# EAGLE design circuit (EAGLE 9.6.2)
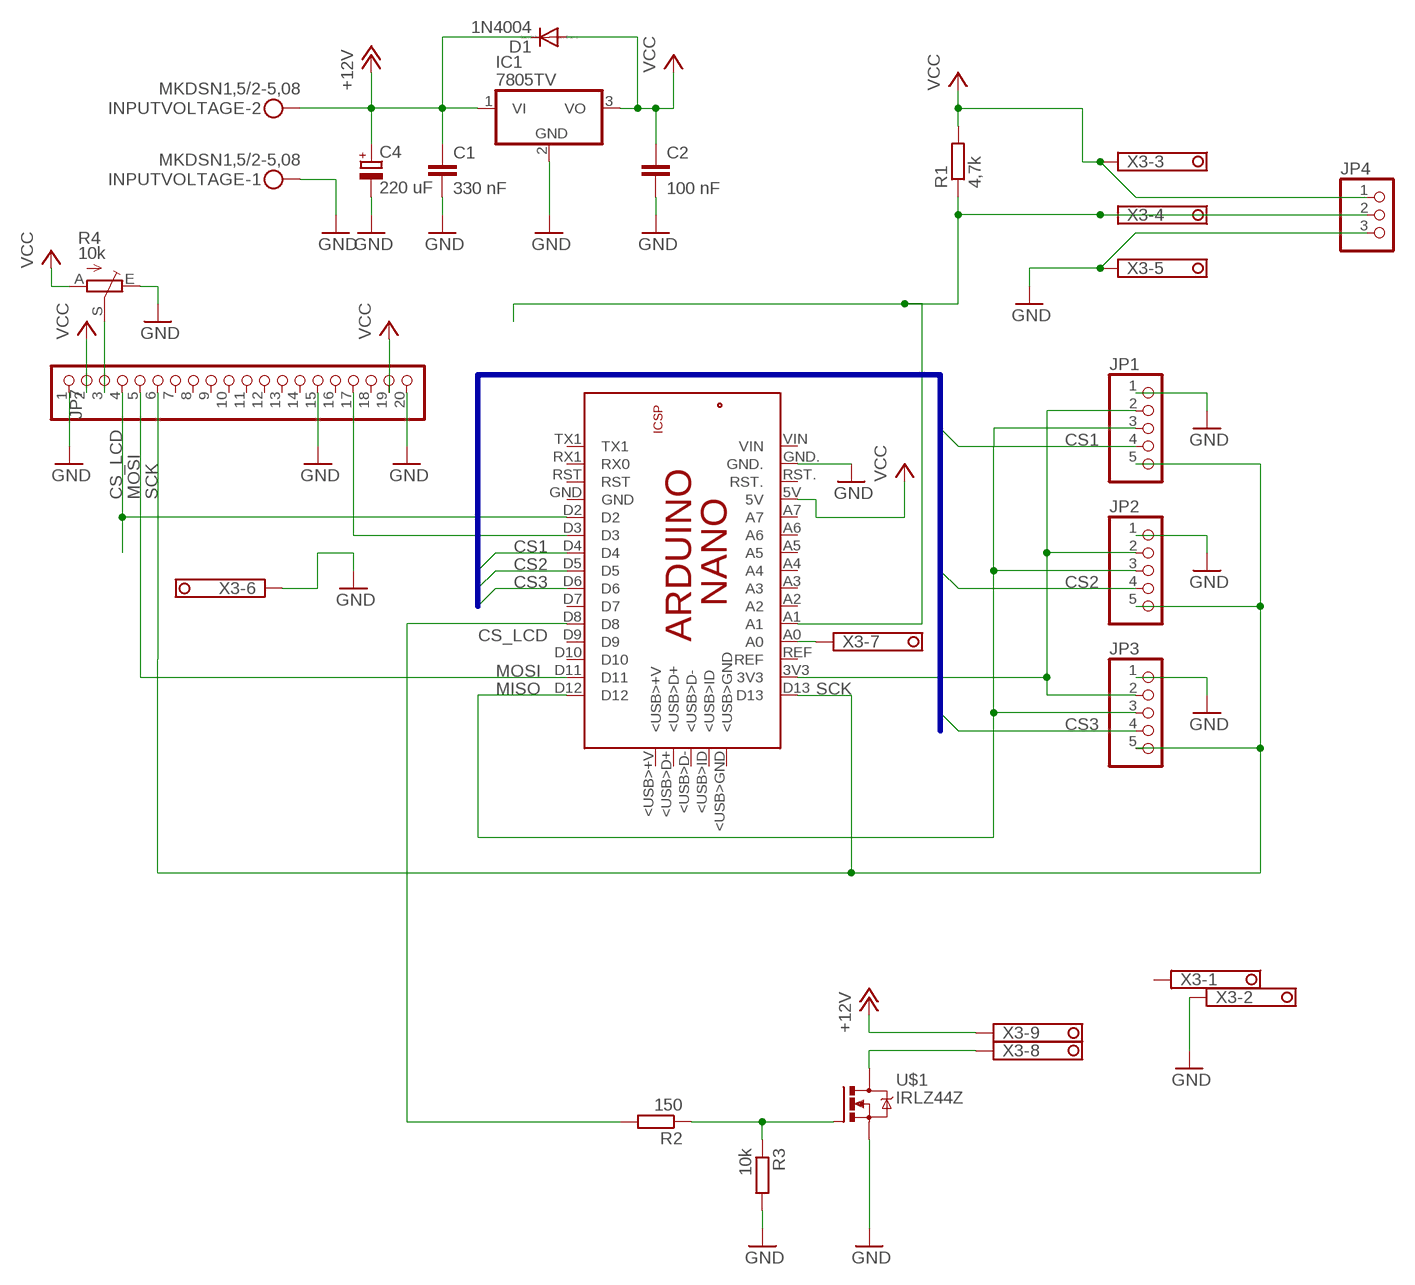
[diagram p0: schematic, sheet 1]

## Parts
C1  330 nF  C-EUC1206  [C1206]
C2  100 nF  C-EUC0603  [C0603]
C4  220 uF  CPOL-EUE3.5-8  [E3,5-8]
D1  1N4004  [DO41-10]
IC1  7805TV  [TO220V]
INPUTVOLTAGE  MKDSN1,5/2-5,08  [MKDSN1,5/2-5,08]
JP1  PINHD-1X5  [1X05]
JP2  PINHD-1X5  [1X05]
JP3  PINHD-1X5  [1X05]
JP4  PINHD-1X3  [1X03]
JP7  PINHD-1X20  [1X20]
PCB1  ARDUINO_NANO  [ARDUINO_NANO]
R1  4,7k  R-EU_0309/12  [0309/12]
R2  150  R-EU_0309/12  [0309/12]
R3  10k  R-EU_0309/12  [0309/12]
R4  10k  TRIM_EU-B64Y  [B64Y]
U$1  IRLZ44Z  [TO220BH]
X3  1751316  [1751316]

## Nets
+12V: C1.1 C4.+ D1.C IC1.1(VI) INPUTVOLTAGE.2 X3.9
CS1: JP1.4 PCB1.D4
CS2: JP2.4 PCB1.D5
CS3: JP3.4 PCB1.D6
CS_LCD: JP7.4 PCB1.D2
GND: C1.2 C2.2 C4.- IC1.2(GND) INPUTVOLTAGE.1 JP1.1 JP2.1 JP3.1 JP4.3 JP7.1 JP7.15 JP7.20 PCB1.GND. R3.2 R4.E U$1.S X3.2 X3.5 X3.6
MISO: JP1.3 JP2.3 JP3.3 PCB1.D12
MOSI: JP7.5 PCB1.D11
N$1: JP7.17 PCB1.D3
N$2: JP4.2 PCB1.A1 R1.1 X3.4
N$3: R2.1 R3.1 U$1.G
N$4: U$1.D X3.8
N$5: PCB1.A0 X3.7
N$6: PCB1.D8 R2.2
N$7: JP1.2 JP2.2 JP3.2 PCB1.3V3
N$32: JP7.3 R4.S
SCK: JP1.5 JP2.5 JP3.5 JP7.6 PCB1.D13
VCC: C2.1 D1.A IC1.3(VO) JP4.1 JP7.2 JP7.19 PCB1.5V R1.2 R4.A X3.3
Unconnected: JP7.7 JP7.8 JP7.9 JP7.10 JP7.11 JP7.12 JP7.13 JP7.14 JP7.16 JP7.18 PCB1.5V. PCB1.<USB>+V PCB1.<USB>D+ PCB1.<USB>D- PCB1.<USB>GND PCB1.<USB>ID PCB1.A2 PCB1.A3 PCB1.A4 PCB1.A5 PCB1.A6 PCB1.A7 PCB1.D7 PCB1.D9 PCB1.D10 PCB1.GND PCB1.GND_ PCB1.MISO PCB1.MOSI PCB1.REF PCB1.RESET.. PCB1.RST PCB1.RST. PCB1.RX1(RX0) PCB1.SCK PCB1.TX1 PCB1.VIN X3.1

## Buses
CS1,CS2,CS3

## Library data of the parts
C1 C2 = resistor:C-EU: CAPACITOR, European symbol
C4 = rcl:CPOL-EU: POLARIZED CAPACITOR, European symbol
D1 = diode:1N4004: DIODE general purpose rectifier, 1 A
IC1 = linear:78*: Positive VOLTAGE REGULATOR Source: http://cache.national.com/ds/LM/LM78L05.pdf http://www.fairchildsemi.com/ds/LM/LM7805.pdf
INPUTVOLTAGE = con-phoenix-508:MKDSN1,5/2-5,08: MKDSN 1,5/ 2-5,08 Printklemme Nennstrom: 13,5 A Nennspannung: 250 V Rastermaß: 5,08 mm Polzahl: 2 Anschlussart: Schraubanschluss Montage: Löten Anschlussrichtung Leiter/Platine: 0 ° Artikelnummer: 1729128 Source: http://eshop.phoenixcontact.com .. 1729128.pdf
JP1-JP3 = pinhead:PINHD-1X5: PIN HEADER
JP4 = pinhead:PINHD-1X3: PIN HEADER
JP7 = pinhead:PINHD-1X20: PIN HEADER
PCB1 = E14_Arduino_revC:ARDUINO_NANO: Device for representing an Arduino Nano board with a footprint in an EAGLE design. Created by Dave Young for Element14. More EAGLE documentation at: http://www.element14.com/community/community/knode/cadsoft_eagle
R1-R3 = rcl:R-EU_: RESISTOR, European symbol; SPICEPREFIX: R
R4 = pot:TRIM_EU-: POTENTIOMETER
U$1 = transistor-power:IRLZ44Z: N-Channel HEXFET® Power MOSFET Logic Level AUTOMOTIVE MOSFET Source: http://www.irf.com/product-info/datasheets/data/irlz44zpbf.pdf
X3 = con-phoenix-350:1751316: MKDS 1/ 9-3,5 Printklemme Nennstrom: 10 A Bemessungsspannung: 160 V Raster: 3,5 mm Polzahl: 9 Montageart: Löten Anschlussart: Schraubanschluss Anschlussrichtung vom Leiter zur Platine: 0° Source: http://eshop.phoenixcontact.com .. 1751316.pdf; OC_FARNELL: unknown; OC_NEWARK: unknown

## Board
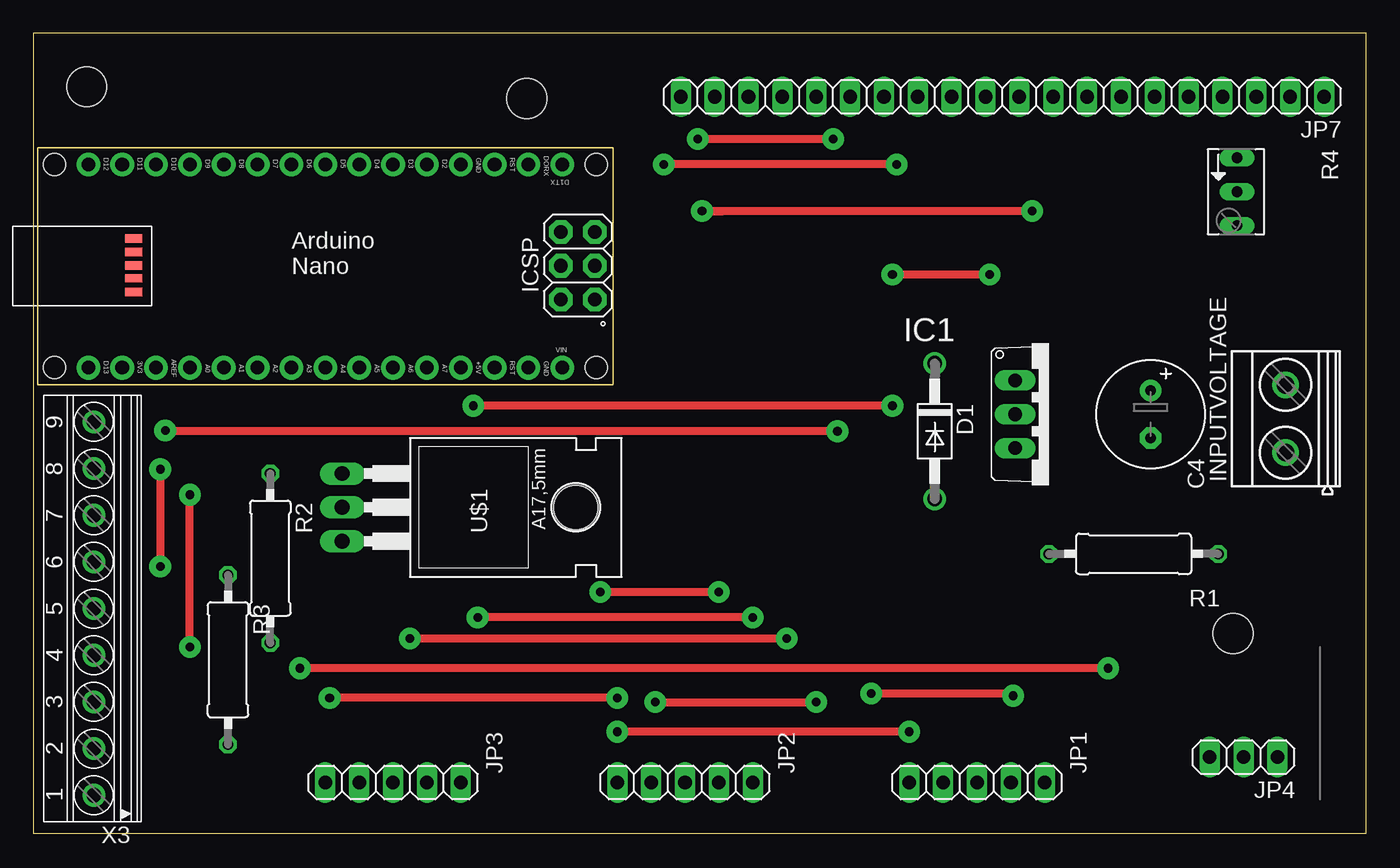
[diagram p1: board, top side]
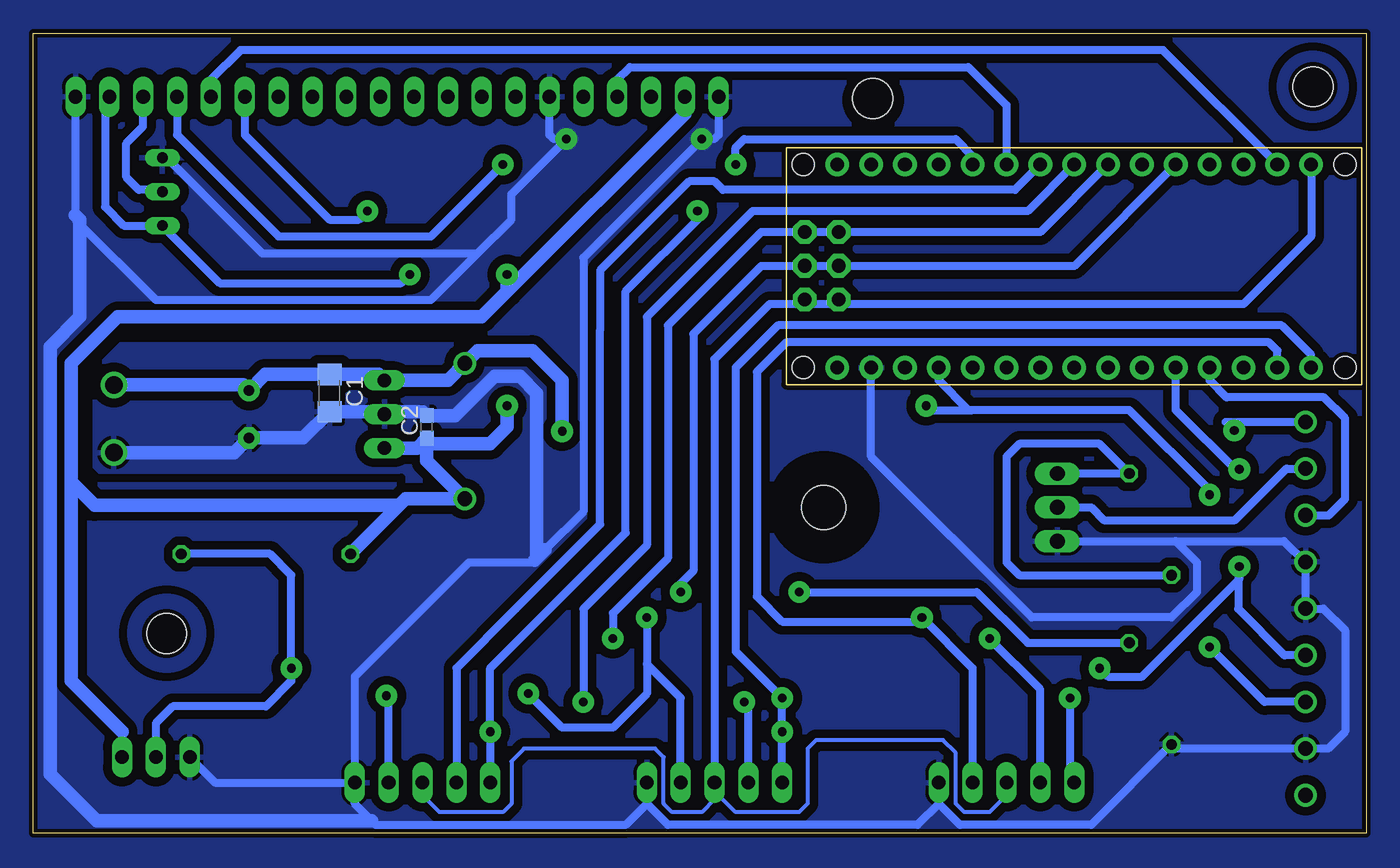
[diagram p2: board, bottom side, seen from below]

Size 100 x 60 mm. Coordinates in mm from the lower left corner, seen from the top.
Outline: 0,0 100,0 100,60 0,60 0,0
Copper layers (1*16): Top 0.035mm / dielectric 1.5mm / Bottom 0.035mm
Design rules "default *": minimum track width 6mil, minimum drill 0.35mm, track to track 26mil, track to pad 26mil, pad to pad 26mil, via to via 26mil, smd to smd 16mil, copper to edge 12.5mil, drill to drill 6mil, minimum pad ring 10mil, minimum via ring 8mil, stop-mask expansion 4mil, vias tented up to drill 0mil, thermal gap 10mil
Holes 3 mm at 37.03,55.12 4,56 90,15
bRestrict: area 86.7,11.7 to 93.3,18.3; area 1,53 to 7,59; area 35,53 to 39,57; area 76.6,32.4 to 79,33.2; 5 lines

### Footprints (pad centres in the part's own frame; a part is rotated, then mirrored left to right if it is on the bottom)
C1206 = smd 1.6 x 1.8: 1 -1.4,0; 2 1.4,0
C0603 = smd 1.1 x 1: 1 -0.85,0; 2 0.85,0
E3,5-8 = drill 0.813 pad 1.6: + -1.778,0 | drill 0.813 pad 1.6 octagon: - 1.778,0
DO41-10 = drill 1.118: A 5.08,0; C -5.08,0
TO220V = drill 1.016 long: 1 -2.54,-2.54; 2 0,-2.54; 3 2.54,-2.54
MKDSN1,5/2-5,08 = drill 1.3 pad 2: 1 -2.561,0.025; 2 2.519,0.025
1X05 = drill 1.016 long: 1 -5.08,0; 2 -2.54,0; 3 0,0; 4 2.54,0; 5 5.08,0
1X03 = drill 1.016 long: 1 -2.54,0; 2 0,0; 3 2.54,0
1X20 = drill 1.016 long: 1 -24.13,0; 2 -21.59,0; 3 -19.05,0; 4 -16.51,0; 5 -13.97,0; 6 -11.43,0; 7 -8.89,0; 8 -6.35,0; 9 -3.81,0; 10 -1.27,0; 11 1.27,0; 12 3.81,0; 13 6.35,0; 14 8.89,0; 15 11.43,0; 16 13.97,0; 17 16.51,0; 18 19.05,0; 19 21.59,0; 20 24.13,0
ARDUINO_NANO = drill 1.016 pad 1.778: 3V3 6.35,1.27; 5V 31.75,1.27; A0 11.43,1.27; A1 13.97,1.27; A2 16.51,1.27; A3 19.05,1.27; A4 21.59,1.27; A5 24.13,1.27; A6 26.67,1.27; A7 29.21,1.27; D2 29.21,16.51; D3 26.67,16.51; D4 24.13,16.51; D5 21.59,16.51; D6 19.05,16.51; D7 16.51,16.51; D8 13.97,16.51; D9 11.43,16.51; D10 8.89,16.51; D11 6.35,16.51; D12 3.81,16.51; D13 3.81,1.27; GND 31.75,16.51; GND. 36.83,1.27; REF 8.89,1.27; RST 34.29,16.51; RST. 34.29,1.27; RX1 36.83,16.51; TX1 39.37,16.51; VIN 39.37,1.27 | drill 1.016 pad 1.778 octagon: 5V. 39.268,6.375; GND_ 39.268,11.455; MISO 41.808,6.375; MOSI 39.268,8.915; RESET.. 41.808,11.455; SCK 41.808,8.915 | smd 1.27 x 0.635: <USB>+V 7.214,10.947; <USB>D+ 7.214,9.957; <USB>D- 7.214,8.941; <USB>GND 7.214,6.96; <USB>ID 7.214,7.976 | hole 1.651: 1.27,1.27; 1.27,16.51; 41.91,16.51; 41.91,1.27
0309/12 = drill 0.813 octagon: 1 -6.35,0; 2 6.35,0
B64Y = drill 0.813 long: A 2.54,0; E -2.54,0; S 0,0
TO220BH = drill 1.118 long: D 0,-6.35; G -2.54,-6.35; S 2.54,-6.35 | hole 3.302: 0,11.176
1751316 = drill 1.1 pad 1.7: 1 -13.973,-0.1; 2 -10.473,-0.1; 3 -6.973,-0.1; 4 -3.473,-0.1; 5 0.028,-0.1; 6 3.527,-0.1; 7 7.027,-0.1; 8 10.527,-0.1; 9 14.027,-0.1

### Placement (x,y rotation side)
C1  77.79,33.02 270 bottom
C2  70.48,30.48 90 bottom
C4  83.82,31.43 270 top
D1  67.63,30.16 270 top
IC1  76.2,31.43 270 top
INPUTVOLTAGE  93.98,31.11 90 top
JP1  70.8,3.81 180 top
JP2  48.9,3.81 180 top
JP3  26.99,3.81 180 top
JP4  90.81,5.71 180 top
JP7  72.71,55.24 180 top
PCB1  0.32,33.66 0 top
R1  82.55,20.95 180 top
R2  17.78,20.64 270 top
R3  14.61,13.02 270 top
R4  90.32,48.12 270 top
U$1  29.53,24.45 270 top
X3  4.45,16.83 90 top

### Tracks (layer width: path | path; a pad name or v marks a point on that pad's centre or on a via)
+12V  (via drill 0.65 pad 1.63)
  Top 0.61: v9.9,30.22 9.96,30.16 v60.33,30.16
  Bottom 0.61: X3.9 10.54,30.86 v9.9,30.22
  Bottom 1.016: INPUTVOLTAGE.2 84.24,33.63 C4.+ 82.61,34.42 C1.1 74.11,34.42 IC1.1 68.9,33.97 D1.C 66.67,36.2 62.55,36.2 60.33,33.97 v60.33,30.16
CS1
  Bottom 0.61: PCB1.D4 26.35,48.26 48.26,48.26 48.9,48.9 50.8,48.9 57.47,42.23 57.47,37.78 57.47,23.18 63.82,16.83 68.26,12.38 JP1.4
CS2  (via drill 0.65 pad 1.63)
  Top 0.61: v46.67,9.84 v58.74,9.84
  Bottom 0.61: PCB1.D5 25.4,46.67 44.77,46.67 45.4,46.67 46.04,46.67 53.98,38.73 53.98,21.59 58.74,16.83 v58.74,9.84 | JP2.4 46.35,9.53 v46.67,9.84
CS3  (via drill 0.65 pad 1.63)
  Top 0.61: v56.52,14.61 v28.26,14.61
  Bottom 0.61: PCB1.D6 24.45,45.09 45.4,45.09 52.39,38.1 52.39,20.64 56.52,16.51 v56.52,14.61 | JP3.4 24.45,10.79 v28.26,14.61
CS_LCD  (via drill 0.65 pad 1.63)
  Top 0.61: v64.77,50.16 v47.31,50.16
  Bottom 0.61: JP7.4 89.22,52.39 81.6,44.77 70.17,44.77 v64.77,50.16 | v47.31,50.16 47.31,51.44 46.67,52.07 30.8,52.07 29.53,50.8 PCB1.D2
GND  (via drill 0.65 pad 1.63)
  Top 0.61: v60.01,52.07 v49.85,52.07
  Bottom 0.61: JP7.1 96.84,46.35 96.84,46.04 90.81,40.01 70.17,40.01 66.67,43.5 | JP4.3 86.36,3.81 JP1.1 | 4.58,20.32 X3.6 | 4.58,20.32 4.54,20.29 X3.5 3.2,16.86 1.59,15.24 1.59,7.62 2.86,6.35 X3.2 14.29,6.36 R3.2 20.64,0.64 30.48,0.64 32.07,2.22 | U$1.S 14.29,21.91 | JP3.1 32.07,2.22 | 32.07,2.22 33.66,0.64 52.39,0.64 53.98,2.22 | JP2.1 53.98,2.22 | 53.98,2.22 55.58,0.62 74.28,0.62 74.61,0.95 75.88,2.22 JP1.1 | 14.29,21.91 12.7,20.32 12.7,18.1 14.61,16.19 25.08,16.19 37.15,28.26 PCB1.GND. | 62.23,20.95 61.91,21.27 61.59,21.27 58.74,24.13 58.74,43.18 v49.85,52.07 48.9,52.07 48.58,52.39 JP7.20 | 62.23,20.64 62.39,20.48 62.55,20.32 67.31,20.32 75.88,11.75 JP1.1 | 4.58,20.32 6.17,21.91 14.29,21.91 | JP7.15 61.28,52.39 60.96,52.07 v60.01,52.07 64.14,47.94 64.14,46.04 66.67,43.5 | R4.E 90,50.66 82.83,43.5 66.67,43.5
  Bottom 1.016: INPUTVOLTAGE.1 84.92,28.55 C4.- 79.75,29.65 C1.2 73.85,31.62 | 73.85,31.62 IC1.2 | 73.85,31.62 70.78,31.62 C2.2 68.36,31.33 65.41,34.29 63.5,34.29 62.23,33.02 62.23,20.95 | 96.84,46.35 96.52,46.04 96.52,38.73 98.74,36.51 98.74,4.45 95.25,0.95 74.61,0.95 | 62.39,20.48 61.59,21.27
  pour Bottom: -4.13,61.28 100.97,61.28 100.97,-1.27 -4.13,-1.27
MISO
  Bottom 0.305: JP3.3 26.99,2.86 28.26,1.59 30.16,1.59 30.8,2.22 30.8,6.03 31.75,6.99 41.27,6.99 41.91,6.35 41.91,2.22 42.55,1.59 47.31,1.59 48.9,3.17 | 48.9,3.17 48.9,3.49 JP2.3 | 48.9,3.17 48.9,2.54 49.85,1.59 52.07,1.59 52.7,2.22 52.7,5.71 53.34,6.35 63.18,6.35 64.14,5.4 64.14,2.22 64.77,1.59 69.53,1.59 70.8,2.86 JP1.3
  Bottom 0.61: PCB1.D12 4.13,44.77 9.21,39.69 44.77,39.69 48.9,35.56 48.9,3.49
MOSI
  Bottom 0.61: PCB1.D11 15.24,58.74 84.45,58.74 86.68,56.52 JP7.5
N$1
  Bottom 0.61: JP7.17 56.2,56.52 55.24,57.47 29.84,57.47 26.99,54.61 PCB1.D3
N$2  (via drill 0.65 pad 1.63)
  Top 0.61: v9.53,27.3 9.53,20.32 9.37,20.16 v9.53,20 | v80.64,12.38 v20,12.38
  Bottom 0.61: JP4.2 90.81,8.26 89.53,9.53 82.55,9.53 80.64,11.43 v80.64,12.38 80.64,19.37 82.23,20.95 R1.1 | X3.4 6.13,13.36 9.61,16.83 9.61,19.92 v9.53,20 9.53,19.05 16.83,11.75 19.37,11.75 v20,12.38 | v9.53,27.3 9.68,27.15 14.29,31.75 PCB1.A1
N$3
  Bottom 0.61: U$1.G R2.1 20,29.21 26.04,29.21 26.99,28.26 26.99,20.32 26.04,19.37 R3.1
N$4
  Bottom 0.61: U$1.D 20.64,24.45 19.68,23.5 9.84,23.5 5.98,27.36 X3.8
N$5
  Bottom 0.61: X3.7 2.81,23.86 1.59,25.08 1.59,31.11 3.17,32.7 10.48,32.7 11.75,33.97 PCB1.A0
N$6  (via drill 0.65 pad 1.63)
  Top 0.61: v51.44,18.1 v42.55,18.1
  Bottom 0.61: PCB1.D8 21.91,42.55 45.4,42.55 50.48,37.47 50.48,19.68 51.75,18.41 v51.44,18.1 | v42.55,18.1 29.21,18.1 25.4,14.29 R2.2
N$7  (via drill 0.65 pad 1.63)
  Top 0.61: v53.98,16.19 v33.34,16.19 | v73.5,10.32 73.5,10.48 v62.87,10.48
  Bottom 0.61: JP3.2 29.53,12.38 v33.34,16.19 33.66,15.88 43.81,15.88 45.72,17.78 45.72,34.61 43.5,36.83 7.3,36.83 6.67,36.2 PCB1.3V3 | v53.98,16.19 53.98,15.88 | v53.98,16.19 53.98,12.7 51.44,10.16 JP2.2 | v53.98,16.19 53.98,10.48 56.52,7.94 60.33,7.94 v62.87,10.48 | JP1.2 73.34,10.16 v73.5,10.32 73.34,10.48
N$32
  Bottom 0.61: R4.S 90.45,48.26 92.08,48.26 93.03,49.21 93.03,51.75 91.76,53.02 JP7.3
NULL
  pour Bottom: -2.54,62.55 102.87,62.55 102.87,-2.54 -3.17,-2.54 -3.17,62.87
SCK  (via drill 0.65 pad 1.63)
  Top 0.61: v65.72,7.62 v43.81,7.62 | v43.81,10.16 v22.23,10.16 | v74.93,46.67 73.66,46.67 v50.16,46.67 51.75,46.67
  Bottom 0.61: PCB1.D13 4.13,35.88 6.35,38.1 44.13,38.1 47.31,34.92 47.31,13.65 v43.81,10.16 v43.81,7.62 JP2.5 | JP1.5 v65.72,7.62 65.72,12.38 55.56,22.54 55.56,40.64 49.85,46.35 v50.16,46.67 | v22.23,10.16 22.23,4.13 JP3.5 | JP7.6 84.14,52.39 77.79,46.04 75.56,46.04 v74.93,46.67
VCC  (via drill 0.65 pad 1.63)
  Top 0.61: v11.75,13.97 v11.75,25.4 | v64.45,32.07 32.7,32.07 v33.02,32.07 | v71.75,41.91 v64.45,41.91
  Bottom 0.61: 94.43,55.11 JP7.2 94.61,54.93 94.61,46.99 93.21,45.59 R4.A 86.01,41.27 72.39,41.27 v71.75,41.91 | X3.3 7.61,9.86 7.62,9.84 v11.75,13.97 | v11.75,25.4 11.75,25.72 17.78,31.75 29.53,31.75 | 29.53,31.75 29.84,31.75 32.07,33.97 PCB1.5V | JP7.19 51.12,53.98 | 29.53,31.75 32.7,31.75 v33.02,32.07 | 93.34,7.62 JP4.1
  Bottom 1.016: IC1.3 71.22,28.89 C2.1 | C2.1 70.48,27.94 D1.A 72.07,25.08 72.55,24.61 | C2.1 70.06,29.21 65.72,29.21 64.45,30.48 v64.45,32.07 | 93.34,7.62 97.16,11.43 97.16,26.35 | 97.16,26.35 97.16,35.24 93.66,38.73 66.36,38.73 64.45,40.64 | 72.55,24.61 R1.2 | 72.55,24.61 95.41,24.61 97.16,26.35 | 64.45,40.64 51.12,53.98 | v64.45,41.91 64.45,40.64

### Text on the board
Bottom: Temperaturmessung Kompressor V2
bRestrict: V2